# EAGLE design schematic_nice (EAGLE 9.4.1)
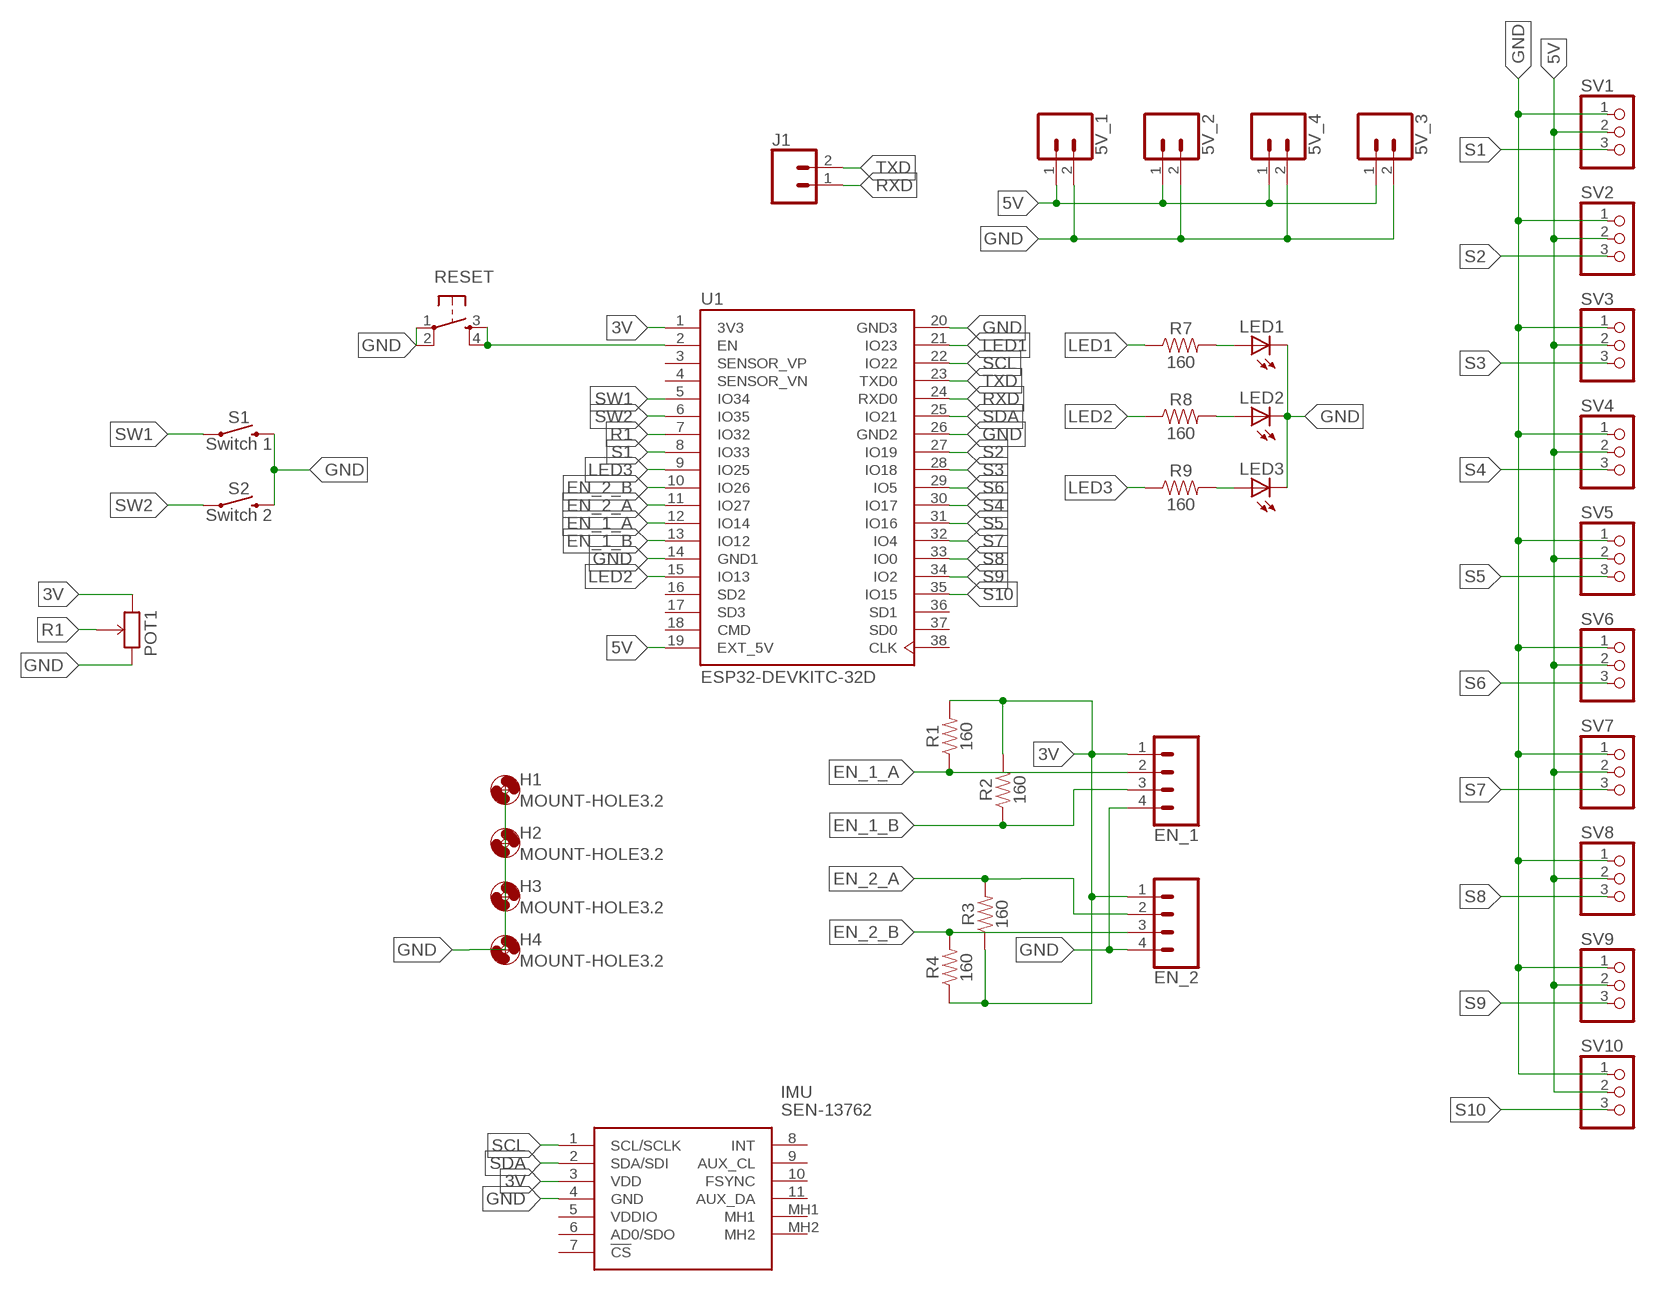
[diagram p0: schematic, sheet 1]

## Parts
5V_1  CONN_02  [1X02]
5V_2  CONN_02  [1X02]
5V_3  CONN_02  [1X02]
5V_4  CONN_02  [1X02]
EN_1  CONN_04  [1X04]
EN_2  CONN_04  [1X04]
H1  MOUNT-HOLE3.2  [3,2]
H2  MOUNT-HOLE3.2  [3,2]
H3  MOUNT-HOLE3.2  [3,2]
H4  MOUNT-HOLE3.2  [3,2]
IMU  SEN-13762  [SEN13762]
J1  CONN_02  [1X02]
LED1  LED3MM  [LED3MM]
LED2  LED3MM  [LED3MM]
LED3  LED3MM  [LED3MM]
POT1  POTENTIOMETER_THT  [POTENTIOMETER]
R1  160  10KOHM-HORIZ-1/4W-1%  [AXIAL-0.3]
R2  160  10KOHM-HORIZ-1/4W-1%  [AXIAL-0.3]
R3  160  10KOHM-HORIZ-1/4W-1%  [AXIAL-0.3]
R4  160  10KOHM-HORIZ-1/4W-1%  [AXIAL-0.3]
R7  160  10KOHM-HORIZ-1/4W-1%  [AXIAL-0.3]
R8  160  10KOHM-HORIZ-1/4W-1%  [AXIAL-0.3]
R9  160  10KOHM-HORIZ-1/4W-1%  [AXIAL-0.3]
RESET  TAC_SWITCHPTH  [TACTILE-PTH]
S1  Switch 1  MOMENTARY-SWITCH-SPST-PTH-12MM  [TACTILE_SWITCH_PTH_12MM]
S2  Switch 2  MOMENTARY-SWITCH-SPST-PTH-12MM  [TACTILE_SWITCH_PTH_12MM]
SV1  PINHD-1X3  [1X03]
SV2  PINHD-1X3  [1X03]
SV3  PINHD-1X3  [1X03]
SV4  PINHD-1X3  [1X03]
SV5  PINHD-1X3  [1X03]
SV6  PINHD-1X3  [1X03]
SV7  PINHD-1X3  [1X03]
SV8  PINHD-1X3  [1X03]
SV9  PINHD-1X3  [1X03]
SV10  PINHD-1X3  [1X03]
U1  ESP32-DEVKITC-32D  [MODULE_ESP32-DEVKITC-32D]

## Nets
3V: EN_1.1 EN_2.1 IMU.3(VDD) POT1.3(CW) R1.P$2 R2.P$2 R3.P$1 R4.P$1 U1.1(3V3)
5V: 5V_1.1 5V_2.1 5V_3.1 5V_4.1 SV1.2 SV2.2 SV3.2 SV4.2 SV5.2 SV6.2 SV7.2 SV8.2 SV9.2 SV10.2 U1.19(EXT_5V)
EN_1_A: EN_1.2 R1.P$1 U1.12(IO14)
EN_1_B: EN_1.3 R2.P$1 U1.13(IO12)
EN_2_A: EN_2.2 R3.P$2 U1.11(IO27)
EN_2_B: EN_2.3 R4.P$2 U1.10(IO26)
GND: 5V_1.2 5V_2.2 5V_3.2 5V_4.2 EN_1.4 EN_2.4 IMU.4(GND) LED1.K(C) LED2.K(C) LED3.K(C) POT1.1(CCW) RESET.1 RESET.2 S1.3 S2.3 SV1.1 SV2.1 SV3.1 SV4.1 SV5.1 SV6.1 SV7.1 SV8.1 SV9.1 SV10.1 U1.14(GND1) U1.20(GND3) U1.26(GND2)
LED1: R7.P$1 U1.21(IO23)
LED2: R8.P$1 U1.15(IO13)
LED3: R9.P$1 U1.9(IO25)
N$1: RESET.3 RESET.4 U1.2(EN)
N$6: LED1.A R7.P$2
N$7: LED2.A R8.P$2
N$8: LED3.A R9.P$2
R1: POT1.2(WIPER) U1.7(IO32)
RXD: J1.1 U1.24(RXD0)
S1: SV1.3 U1.8(IO33)
S2: SV2.3 U1.27(IO19)
S3: SV3.3 U1.28(IO18)
S4: SV4.3 U1.30(IO17)
S5: SV5.3 U1.31(IO16)
S6: SV6.3 U1.29(IO5)
S7: SV7.3 U1.32(IO4)
S8: SV8.3 U1.33(IO0)
S9: SV9.3 U1.34(IO2)
S10: SV10.3 U1.35(IO15)
SCL: IMU.1(SCL/SCLK) U1.22(IO22)
SDA: IMU.2(SDA/SDI) U1.25(IO21)
SW1: S1.1 U1.5(IO34)
SW2: S2.1 U1.6(IO35)
TXD: J1.2 U1.23(TXD0)
Unconnected: IMU.5(VDDIO) IMU.6(AD0/SDO) IMU.7(!CS) IMU.8(INT) IMU.9(AUX_CL) IMU.10(FSYNC) IMU.11(AUX_DA) IMU.MH1 IMU.MH2 U1.3(SENSOR_VP) U1.4(SENSOR_VN) U1.16(SD2) U1.17(SD3) U1.18(CMD) U1.36(SD1) U1.37(SD0) U1.38(CLK)

## Library data of the parts
5V_1-5V_4 J1 = SparkFun-Connectors:CONN_02: Multi connection point. Often used as Generic Header-pin footprint for 0.1 inch spaced/style header connections On any of the 0.1 inch spaced packages, you can populate with these: Break Away Headers - Straight <https://www.sparkfun.com/products/116> (PRT-00116) Break Away Male Headers - Right Angle <https://www.sparkfun.com/products/553> (PRT-00553) Female Headers <https://www.sparkfun.com/products/115> (PRT-00115) Break Away Headers - Machine Pin <https://www.sparkfun.com/products/117> (PRT-00117) Break Away Female Headers - Swiss Machine Pin <https://www.sparkfun.com/products/743> (PRT-00743) For SCREWTERMINALS and SPRING TERMINALS visit here: Screw Terimnals on SparkFun.com <https://www.sparkfun.com/search/results?term=Screw+Terminals> (5mm/3.5mm/2.54mm spacing) This device is also useful as a general connection point to wire up your design to another part of your project. Our various solder wires solder well into these plated through hole pads. Hook-Up Wire - Assortment (Stranded, 22 AWG) <https://www.sparkfun.com/products/11375> (PRT-11375) Hook-Up Wire - Assortment (Solid Core, 22 AWG) <https://www.sparkfun.com/products/11367> (PRT-11367) View the entire wire category on our website here <https://www.sparkfun.com/categories/141> Special notes: Molex polarized connector foot print use with: PRT-08233 with associated crimp pins and housings. 2.54_SCREWTERM for use with PRT-10571. 3.5mm Screw Terminal footprints for PRT-08084 5mm Screw Terminal footprints for use with PRT-08432
EN_1 EN_2 = SparkFun-Connectors:CONN_04: Multi connection point. Often used as Generic Header-pin footprint for 0.1 inch spaced/style header connections On any of the 0.1 inch spaced packages, you can populate with these: Break Away Headers - Straight <https://www.sparkfun.com/products/116> (PRT-00116) Break Away Male Headers - Right Angle <https://www.sparkfun.com/products/553> (PRT-00553) Female Headers <https://www.sparkfun.com/products/115> (PRT-00115) Break Away Headers - Machine Pin <https://www.sparkfun.com/products/117> (PRT-00117) Break Away Female Headers - Swiss Machine Pin <https://www.sparkfun.com/products/743> (PRT-00743) For SCREWTERMINALS and SPRING TERMINALS visit here: Screw Terimnals on SparkFun.com <https://www.sparkfun.com/search/results?term=Screw+Terminals> (5mm/3.5mm/2.54mm spacing) This device is also useful as a general connection point to wire up your design to another part of your project. Our various solder wires solder well into these plated through hole pads. Hook-Up Wire - Assortment (Stranded, 22 AWG) <https://www.sparkfun.com/products/11375> (PRT-11375) Hook-Up Wire - Assortment (Solid Core, 22 AWG) <https://www.sparkfun.com/products/11367> (PRT-11367) View the entire wire category on our website here <https://www.sparkfun.com/categories/141> Special notes: Molex polarized connector foot print use with SKU : PRT-08231 with associated crimp pins and housings. 1MM SMD Version SKU: PRT-10208; PROD_ID: CONN-09696
H1-H4 = holes:MOUNT-HOLE: MOUNTING HOLE with drill center marker
IMU = SEN-13762:SEN-13762: SPARKFUN IMU BREAKOUT - MPU-9250 Source: Datasheet <https://learn.sparkfun.com/tutorials/mpu-9250-hookup-guide?_ga=2.147766003.557836013.1526919598-864620925.1504478805>; DESCRIPTION: SPARKFUN IMU BREAKOUT - MPU-9250; HEIGHT: 3mm; MANUFACTURER_NAME: SparkFun Electronics; MANUFACTURER_PART_NUMBER: SEN-13762
LED1-LED3 = adafruit:LED: LED OSRAM: - CHIPLED LG R971, LG N971, LY N971, LG Q971, LY Q971, LO R971, LY R971 LH N974, LH R974 LS Q976, LO Q976, LY Q976 LO Q996 - Hyper CHIPLED LW Q18S LB Q993, LB Q99A, LB R99A - SideLED LS A670, LO A670, LY A670, LG A670, LP A670 LB A673, LV A673, LT A673, LW A673 LH A674 LY A675 LS A676, LA A676, LO A676, LY A676, LW A676 LS A679, LY A679, LG A679 - Hyper Micro SIDELED® LS Y876, LA Y876, LO Y876, LY Y876 LT Y87S - SmartLED LW L88C, LW L88S LB L89C, LB L89S, LG L890 LS L89K, LO L89K, LY L89K LS L896, LA L896, LO L896, LY L896 - TOPLED LS T670, LO T670, LY T670, LG T670, LP T670 LSG T670, LSP T670, LSY T670, LOP T670, LYG T670 LG T671, LOG T671, LSG T671 LB T673, LV T673, LT T673, LW T673 LH T674 LS T676, LA T676, LO T676, LY T676, LB T676, LH T676, LSB T676, LW T676 LB T67C, LV T67C, LT T67C, LS T67K, LO T67K, LY T67K, LW E67C LS E67B, LA E67B, LO E67B, LY E67B, LB E67C, LV E67C, LT E67C LW T67C LS T679, LY T679, LG T679 LS T770, LO T770, LY T770, LG T770, LP T770 LB T773, LV T773, LT T773, LW T773 LH T774 LS E675, LA E675, LY E675, LS T675 LS T776, LA T776, LO T776, LY T776, LB T776 LHGB T686 LT T68C, LB T68C - Hyper Mini TOPLED® LB M676 - Mini TOPLED Santana® LG M470 LS M47K, LO M47K, LY M47K Source: http://www.osram.convergy.de/
POT1 = GamePad:POTENTIOMETER: Potentiometer [Rapid - 68-0242]
R1-R4 R7-R9 = SparkFun-Resistors:10KOHM: 10kΩ resistor A resistor is a passive two-terminal electrical component that implements electrical resistance as a circuit element. Resistors act to reduce current flow, and, at the same time, act to lower voltage levels within circuits. - Wikipedia; PROD_ID: RES-12183; VALUE: 10k
RESET = SparkFun-Retired:TAC_SWITCH: Momentary Switch Button commonly used for reset or general input. Spark Fun Electronics SKU : COM-00097 SMT- SWCH-08247
S1 S2 = SparkFun-Switches:MOMENTARY-SWITCH-SPST: Momentary Switch (Pushbutton) - SPST Normally-open (NO) SPST momentary switches (buttons, pushbuttons). Variants PTH-12MM - 12mm square, through-hole Momentary Pushbutton Switch - 12mm Square <https://www.sparkfun.com/products/9190> (COM-09190) PTH-6.0MM, PTH-6.0MM-KIT - 6.0mm square, through-hole Mini Pushbutton Switch <https://www.sparkfun.com/products/97> (COM-00097) KIT package intended for soldering kit's - only one side of pads' copper is exposed. PTH-RIGHT-ANGLE-KIT - Right-angle, through-hole Right Angle Tactile Button <https://www.sparkfun.com/products/10791> - Used on SparkFun BigTime Watch Kit <https://www.sparkfun.com/products/11734> SMD-12MM - 12mm square, surface-mount Tactile Button - SMD (12mm) <https://www.sparkfun.com/products/12993> (COM-12993) Used on SparkFun PicoBoard <https://www.sparkfun.com/products/11888> SMD-4.5MM - 4.5mm Square Trackball Switch Used on SparkFun Blackberry Trackballer Breakout <https://www.sparkfun.com/products/13169> SMD-4.6MMX2.8MM - 4.60mm x 2.80mm, surface mount Used on SparkFun SAMD21 Mini Breakout <https://www.sparkfun.com/products/13664> SMD-5.2MM, SMD-5.2-REDUNDANT - 5.2mm square, surface-mount Mini Pushbutton Switch - SMD <https://www.sparkfun.com/products/8720> (COM-08720) Used on Arduino Pro Mini <https://www.sparkfun.com/products/11114> REDUNDANT package connects both switch circuits together SMD-6.0X3.5MM - 6.0 x 3.5mm, surface mount Momentary Reset Switch SMD <https://www.sparkfun.com/products/8229> (COM-08229) SMD-6.2MM-TALL - 6.2mm square, surface mount Tactile Button - SMD (6mm) <https://www.sparkfun.com/products/12992> Used on SparkFun Digital Sandbox <https://www.sparkfun.com/products/12651> SMD-RIGHT-ANGLE - Right-angle, surface mount Used on SparkFun Block for Intel® Edison - Arduino <https://www.sparkfun.com/products/13036>; PROD_ID: SWCH-09185; SF_SKU: COM-09190
SV1-SV10 = adafruit:PINHD-1X3: PIN HEADER
U1 = ESP32-DEVKITC-32D:ESP32-DEVKITC-32D: Eval Board For Esp-Wroom-32; AVAILABILITY: Unavailable; DESCRIPTION: EVAL BOARD FOR ESP-WROOM-32; MF: Espressif Systems; MP: ESP32-DEVKITC-32D; PACKAGE: None; PRICE: None

## Board
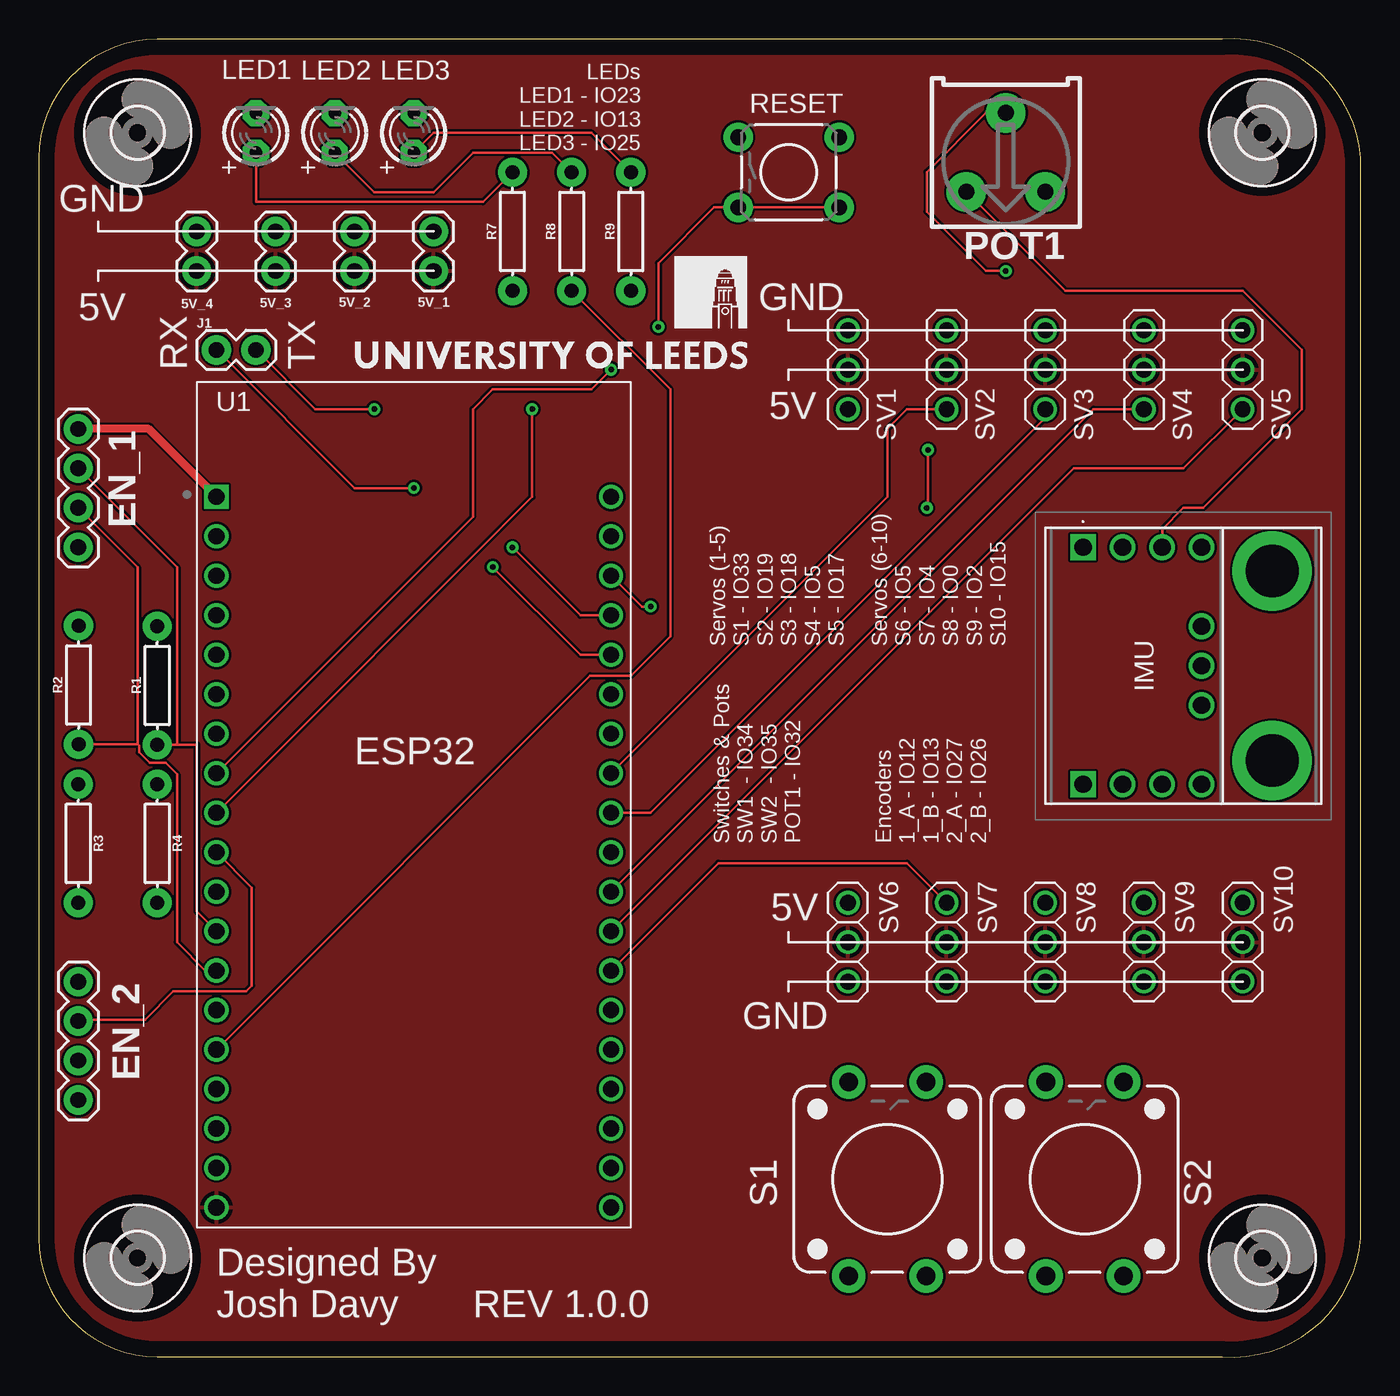
[diagram p1: board, top side]
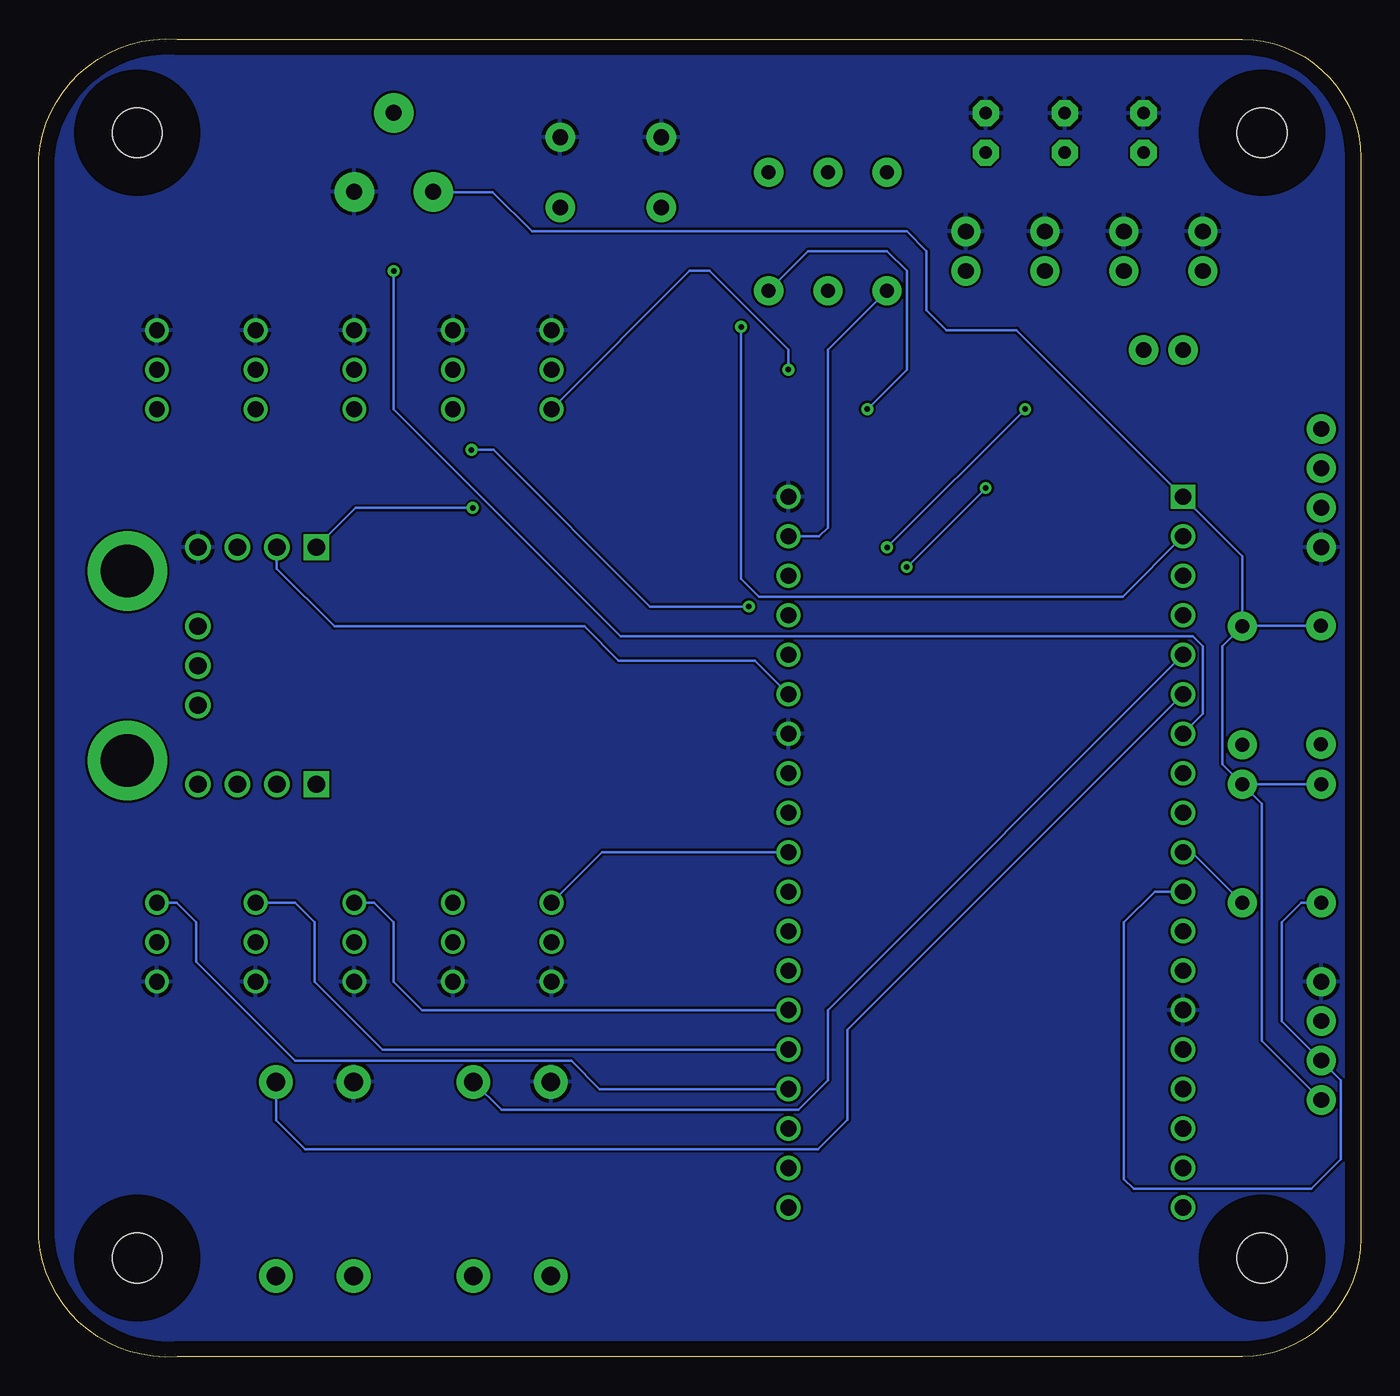
[diagram p2: board, bottom side, seen from below]

Size 85.07 x 84.81 mm. Coordinates in mm from the lower left corner, seen from the top.
Outline: 76.18,84.78 7.62,84.78 arc90 0,77.16 0,7.64 arc90 7.62,0.02 76.18,0.02 arc90 85.07,7.64 85.07,77.16 arc90 76.18,84.78
Copper layers (1*16): Top 0.035mm / dielectric 1.5mm / Bottom 0.035mm
Design rules "default": minimum track width 6mil, minimum drill 0.35mm, track to track 6mil, track to pad 6mil, pad to pad 6mil, via to via 6mil, smd to smd 6mil, copper to edge 40mil, drill to drill 6mil, minimum pad ring 10mil, minimum via ring 8mil, stop-mask expansion 4mil, vias tented up to drill 0mil, thermal gap 10mil

### Footprints (pad centres in the part's own frame; a part is rotated, then mirrored left to right if it is on the bottom)
1X02 = drill 1.016 pad 1.88: 1 0,0; 2 2.54,0
1X04 = drill 1.016 pad 1.88: 1 0,0; 2 2.54,0; 3 5.08,0; 4 7.62,0
3,2 = hole 3.2: 0,0
SEN13762 = drill 1.11 pad 1.665 square: 1 -6.449,7.62; 5 -6.449,-7.62 | drill 1.11 pad 1.665: 2 -3.909,7.62; 3 -1.369,7.62; 4 1.171,7.62; 6 -3.909,-7.62; 7 -1.369,-7.62; 8 1.171,-7.62; 9 1.171,2.54; 10 1.171,0; 11 1.171,-2.54 | drill 3.4 pad 5.1: MH1 5.715,6.096; MH2 5.715,-6.096
LED3MM = drill 0.813 pad 1.676 octagon: A -1.27,0; K 1.27,0
POTENTIOMETER = drill 1.016 pad 2.54: 1 -2.54,2.525; 2 0,-2.555; 3 2.54,2.525
AXIAL-0.3 = drill 0.9 pad 1.88: P$1 -3.81,0; P$2 3.81,0
TACTILE-PTH = drill 1.016 pad 1.88: 1 -3.251,2.261; 2 3.251,2.261; 3 -3.251,-2.261; 4 3.251,-2.261
TACTILE_SWITCH_PTH_12MM = drill 1.2 pad 2.159: 1 6.25,-2.5; 2 -6.25,-2.5; 3 6.25,2.5; 4 -6.25,2.5
1X03 = drill 1.016: 1 -2.54,0; 2 0,0; 3 2.54,0
MODULE_ESP32-DEVKITC-32D = drill 1.04 square: 1 -12.7,19.76 | drill 1.04: 2 -12.7,17.22; 3 -12.7,14.68; 4 -12.7,12.14; 5 -12.7,9.6; 6 -12.7,7.06; 7 -12.7,4.52; 8 -12.7,1.98; 9 -12.7,-0.56; 10 -12.7,-3.1; 11 -12.7,-5.64; 12 -12.7,-8.18; 13 -12.7,-10.72; 14 -12.7,-13.26; 15 -12.7,-15.8; 16 -12.7,-18.34; 17 -12.7,-20.88; 18 -12.7,-23.42; 19 -12.7,-25.96; 20 12.7,19.76; 21 12.7,17.22; 22 12.7,14.68; 23 12.7,12.14; 24 12.7,9.6; 25 12.7,7.06; 26 12.7,4.52; 27 12.7,1.98; 28 12.7,-0.56; 29 12.7,-3.1; 30 12.7,-5.64; 31 12.7,-8.18; 32 12.7,-10.72; 33 12.7,-13.26; 34 12.7,-15.8; 35 12.7,-18.34; 36 12.7,-20.88; 37 12.7,-23.42; 38 12.7,-25.96

### Placement (x,y rotation side)
5V_1  25.4,69.87 90 top
5V_2  20.32,69.87 90 top
5V_3  15.24,69.87 90 top
5V_4  10.16,69.87 90 top
EN_1  2.54,59.71 270 top
EN_2  2.54,16.53 90 top
H1  6.35,6.37 0 top
H2  6.35,78.76 0 top
H3  78.74,78.76 0 top
H4  78.74,6.37 0 top
IMU  73.66,44.47 0 top
J1  11.43,64.79 0 top
LED1  13.97,78.76 90 top
LED2  19.05,78.76 90 top
LED3  24.13,78.76 90 top
POT1  62.23,77.49 180 top
R1  7.62,43.2 90 top
R2  2.56,43.24 90 top
R3  2.54,33.04 270 top
R4  7.62,33.04 270 top
R7  30.48,72.41 90 top
R8  34.29,72.41 90 top
R9  38.1,72.41 90 top
RESET  48.26,76.22 0 top
S1  54.61,11.45 90 top
S2  67.31,11.45 90 top
SV1  52.07,63.52 270 top
SV2  58.42,63.52 270 top
SV3  64.77,63.52 270 top
SV4  71.12,63.52 270 top
SV5  77.47,63.52 270 top
SV6  52.07,26.69 90 top
SV7  58.42,26.69 90 top
SV8  64.77,26.69 90 top
SV9  71.12,26.69 90 top
SV10  77.47,26.69 90 top
U1  24.13,35.58 0 top
U$1  [LOGO_LARGE]  20.32,63.52 0 top

### Tracks (layer width: path | path; a pad name or v marks a point on that pad's centre or on a via)
3V
  Top 0.152: POT1.3 66.06,68.6 77.47,68.6 81.28,64.79 81.28,60.98 74.93,54.63 73.66,54.63 72.29,53.26 IMU.3
  Top 0.508: U1.1 7.06,59.71 EN_1.1
  Bottom 0.152: R1.P$2 7.59,47.05 R2.P$2 | R1.P$2 7.62,51.53 U1.1 22.15,66.06 26.67,66.06 27.94,67.33 27.94,71.14 29.21,72.41 53.34,72.41 55.88,74.95 59.67,74.95 POT1.3 | R3.P$1 R4.P$1 | R4.P$1 6.35,35.58 6.35,20.34 EN_2.1 | R1.P$2 8.89,45.74 8.89,38.12 R4.P$1
5V
  pour Top: -27.94,19.07 7.62,-16.49 124.46,-16.49 132.08,-8.87 132.08,73.68 116.84,88.92 115.57,90.19 -29.21,90.19 -29.21,87.65 -27.94,86.38
EN_1_A
  Top 0.152: EN_1.2 8.89,50.82 8.89,39.39 | U1.12 10.16,28.67 10.16,39.39 8.89,39.39 | R1.P$1 8.89,39.39
EN_1_B
  Top 0.152: EN_1.3 6.35,50.82 6.35,39.43 | R2.P$1 6.35,39.43 | 6.35,39.43 6.45,39.33 6.45,38.91 7.14,38.23 8.15,38.23 8.89,37.49 8.89,26.69 10.72,24.86 U1.13
EN_2_A
  Bottom 0.152: R3.P$2 3.81,29.23 5.08,27.96 5.08,21.61 EN_2.2 1.27,17.8 1.27,12.72 3.17,10.82 14.61,10.82 15.24,11.45 15.24,27.96 13.26,29.94 U1.11
EN_2_B
  Top 0.152: EN_2.3 2.64,21.72 6.83,21.72 8.64,23.52 13.34,23.52 13.71,23.89 13.71,30.2 U1.10
  Bottom 0.152: R4.P$2 10.87,32.48 U1.10
GND
  pour Bottom: -8.89,96.54 -8.89,-5.71 arc45 -6.66,-11.1 0,-17.76 93.36,-17.76 arc45 98.75,-15.52 101.6,-12.68 101.6,89.58 arc45 99.37,94.97 95.25,99.08 -3.19,99.08 arc45 -8.58,96.85
LED1
  Bottom 0.152: R7.P$1 34.29,64.79 34.29,53.36 34.85,52.8 U1.21
LED2
  Top 0.152: U1.15 35.48,43.84 38.1,43.84 40.64,46.38 40.64,62.25 R8.P$1
LED3  (via drill 0.35)
  Top 0.152: U1.9 31.75,55.34 v31.75,60.98
  Bottom 0.152: v31.75,60.98 29.21,63.52 29.21,69.87 30.48,71.14 35.56,71.14 R9.P$1
N$1  (via drill 0.35)
  Top 0.152: RESET.4 RESET.3 43.46,73.96 39.88,70.38 v39.88,66.28
  Bottom 0.152: v39.88,66.28 39.88,50.06 38.73,48.92 15.31,48.92 U1.2
N$6
  Top 0.152: R7.P$2 28.57,74.32 13.97,74.32 LED1.A
N$7
  Top 0.152: R8.P$2 33.02,77.49 27.94,77.49 25.4,74.95 21.59,74.95 LED2.A
N$8
  Top 0.152: R9.P$2 35.56,78.76 25.4,78.76 LED3.A
R1  (via drill 0.35)
  Top 0.152: POT1.2 60.96,80.05 57.14,76.23 57.14,73.69 60.96,69.87 v62.23,69.87
  Bottom 0.152: U1.7 10.16,41.37 10.16,45.74 10.79,46.38 47.62,46.38 62.23,60.98 v62.23,69.87
RXD  (via drill 0.35)
  Top 0.152: v24.13,55.9 20.32,55.9 J1.1 | v29.21,50.82 34.85,45.18 U1.24
  Bottom 0.152: v24.13,55.9 v29.21,50.82
S1  (via drill 0.35)
  Top 0.152: U1.8 27.94,54.07 27.94,60.98 29.21,62.25 35.56,62.25 v36.83,63.52
  Bottom 0.152: v36.83,63.52 36.83,64.79 41.91,69.87 43.18,69.87 SV1.3
S2
  Top 0.152: U1.27 54.61,55.34 54.61,59.71 55.88,60.98 SV2.3
S3
  Top 0.152: U1.28 39.37,35.02 64.77,60.42 SV3.3
S4
  Top 0.152: U1.30 67.87,60.98 SV4.3
S5
  Top 0.152: U1.31 66.6,57.17 73.66,57.17 SV5.3
S6
  Bottom 0.152: U1.29 45.72,32.48 46.28,32.48 48.82,32.48 SV6.3
S7
  Top 0.152: U1.32 43.74,31.77 55.88,31.77 SV7.3
S8
  Bottom 0.152: U1.33 60.4,22.32 62.23,24.15 62.23,27.96 63.5,29.23 SV8.3
S9
  Bottom 0.152: U1.34 62.94,19.78 67.31,24.15 67.31,27.96 68.58,29.23 SV9.3
S10
  Bottom 0.152: U1.35 48.97,17.24 50.8,19.07 68.58,19.07 74.93,25.42 74.93,27.96 76.2,29.23 SV10.3
SCL  (via drill 0.35)
  Top 0.152: U1.22 38.81,48.28 v39.37,48.28 | v57.15,54.63 57.22,54.71 v57.22,58.37
  Bottom 0.152: v39.37,48.28 45.72,48.28 55.81,58.37 v57.22,58.37 | v57.15,54.63 64.67,54.63 IMU.1
SDA
  Bottom 0.152: U1.25 38.99,44.8 47.75,44.8 49.96,47.01 66.04,47.01 69.75,50.72 IMU.2
SW1
  Bottom 0.152: U1.5 34.29,22.32 34.29,17.8 36.2,15.9 55.3,15.9 S1.1
SW2
  Bottom 0.152: U1.6 33.02,21.05 33.02,15.26 34.92,13.36 67.94,13.36 69.81,15.22 S2.1
TXD  (via drill 0.35)
  Top 0.152: U1.23 34.85,47.72 v30.48,52.09 | v21.59,60.98 17.78,60.98 J1.2
  Bottom 0.152: v30.48,52.09 v21.59,60.98

### Text on the board
tNames: LEDs / LED1 - IO23 / LED2 - IO13 / LED3 - IO25 | GND | 5V | GND | RX | TX | 5V | Servos (1-5) / S1 - IO33 / S2 - IO19 / S3 - IO18 / S4 - IO5 / S5 - IO17 | Servos (6-10) / S6 - IO5 / S7 - IO4 / S8 - IO0 / S9 - IO2 / S10 - IO15 | ESP32 | Switches & Pots / SW1 - IO34 / SW2 - IO35 / POT1 - IO32 | Encoders / 1_A - IO12 / 1_B - IO13 / 2_A - IO27 / 2_B - IO26 | 5V | GND | S1 | S2 | Designed By / Josh Davy | REV 1.0.0